# EAGLE design main (EAGLE 9.6.2)
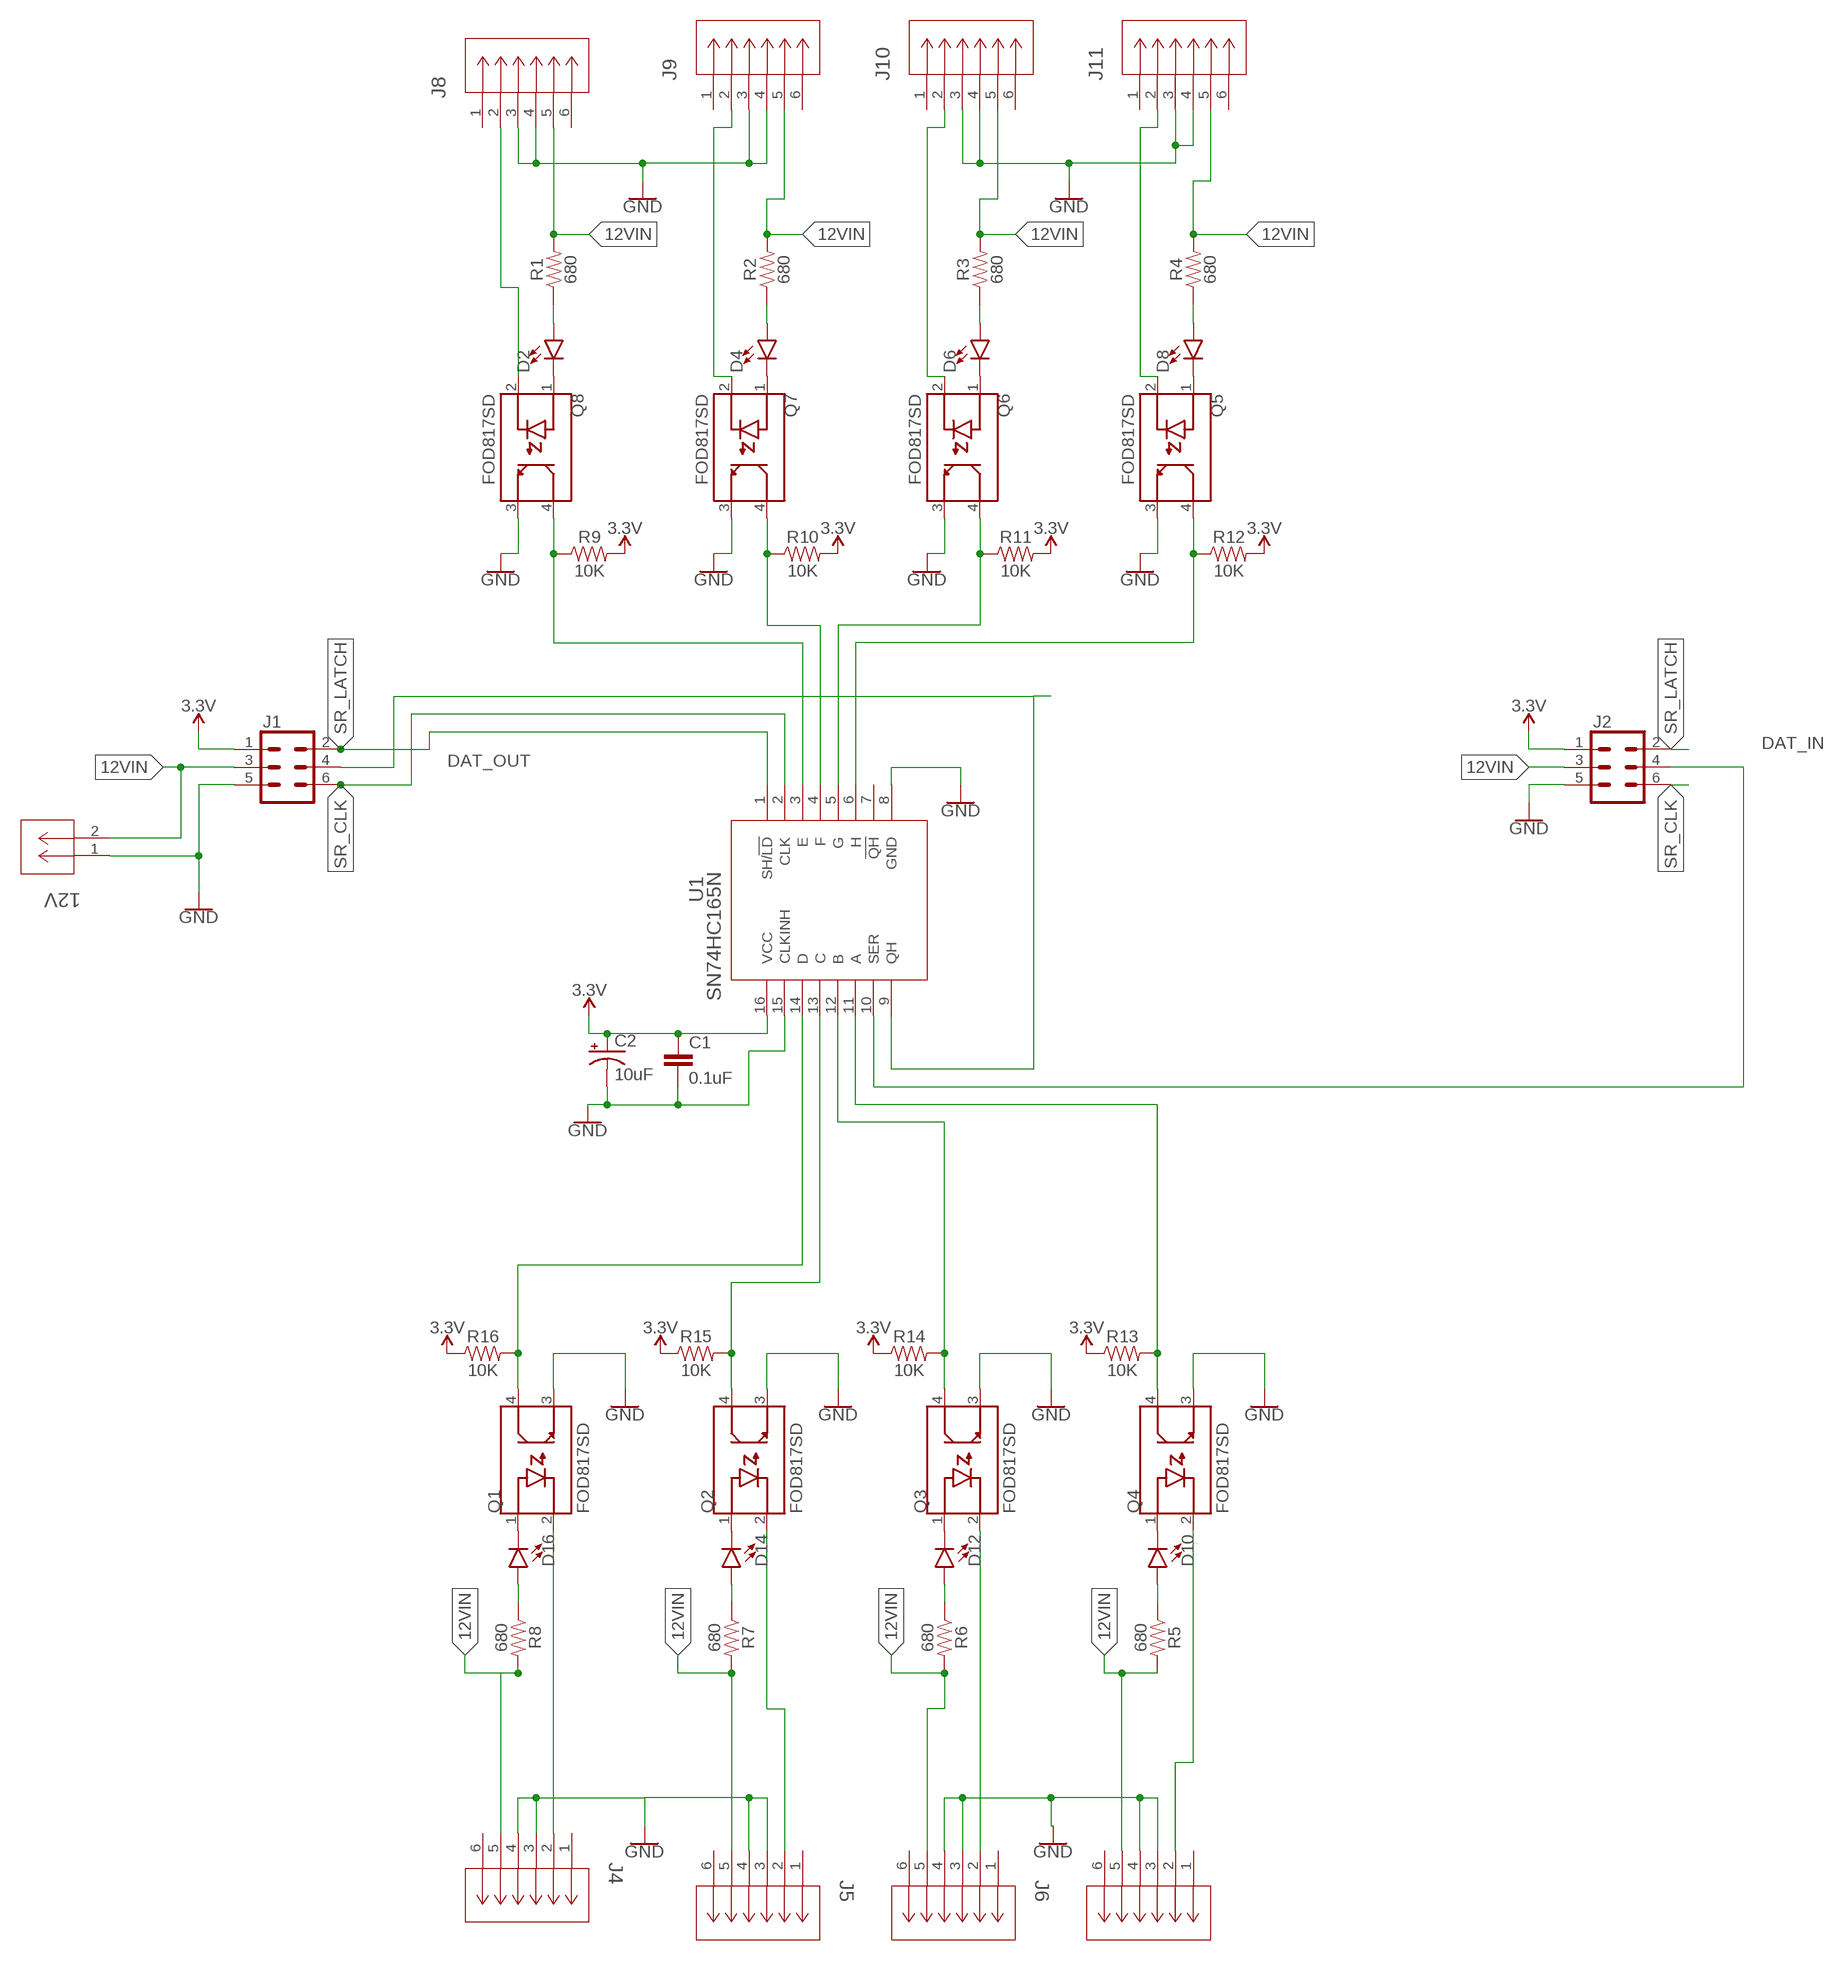
[diagram p0: schematic, sheet 1]

## Parts
12V  1725656  [CONN_1725656_PXC]
C1  0.1uF  0.1UF-0603-25V-5%  [0603]
C2  10uF  10UF-POLAR-RADIAL-2.5MM-25V-20%  [CPOL-RADIAL-2.5MM-5MM]
D2  LED0603  [LED-0603]
D4  LED0603  [LED-0603]
D6  LED0603  [LED-0603]
D8  LED0603  [LED-0603]
D10  LED0603  [LED-0603]
D12  LED0603  [LED-0603]
D14  LED0603  [LED-0603]
D16  LED0603  [LED-0603]
J1  CONN_03X2SHROUD  [2X3-SHROUDED]
J2  CONN_03X2SHROUD  [2X3-SHROUDED]
J4  E5566-Q0LK22-L  [CONN6_E5566_PUL]
J5  E5566-Q0LK22-L  [CONN6_E5566_PUL]
J6  E5566-Q0LK22-L  [CONN6_E5566_PUL]
J7  E5566-Q0LK22-L  [CONN6_E5566_PUL]
J8  E5566-Q0LK22-L  [CONN6_E5566_PUL]
J9  E5566-Q0LK22-L  [CONN6_E5566_PUL]
J10  E5566-Q0LK22-L  [CONN6_E5566_PUL]
J11  E5566-Q0LK22-L  [CONN6_E5566_PUL]
Q1  FOD817SD  [SOIC254P1016X385-4N]
Q2  FOD817SD  [SOIC254P1016X385-4N]
Q3  FOD817SD  [SOIC254P1016X385-4N]
Q4  FOD817SD  [SOIC254P1016X385-4N]
Q5  FOD817SD  [SOIC254P1016X385-4N]
Q6  FOD817SD  [SOIC254P1016X385-4N]
Q7  FOD817SD  [SOIC254P1016X385-4N]
Q8  FOD817SD  [SOIC254P1016X385-4N]
R1  680  RESISTOR1206  [1206]
R2  680  RESISTOR1206  [1206]
R3  680  RESISTOR1206  [1206]
R4  680  RESISTOR1206  [1206]
R5  680  RESISTOR1206  [1206]
R6  680  RESISTOR1206  [1206]
R7  680  RESISTOR1206  [1206]
R8  680  RESISTOR1206  [1206]
R9  10K  RESISTOR0603  [0603]
R10  10K  RESISTOR0603  [0603]
R11  10K  RESISTOR0603  [0603]
R12  10K  RESISTOR0603  [0603]
R13  10K  RESISTOR0603  [0603]
R14  10K  RESISTOR0603  [0603]
R15  10K  RESISTOR0603  [0603]
R16  10K  RESISTOR0603  [0603]
U1  SN74HC165N  [N16]

## Nets
3.3V: C1.1 C2.1(+) J1.1 J2.1 R9.2 R10.2 R11.2 R12.2 R13.1 R14.1 R15.1 R16.1 U1.16(VCC)
12VIN: 12V.2 J1.3 J2.3 J4.5 J5.5 J6.5 J7.5 J8.5 J9.5 J10.5 J11.5 R1.2 R2.2 R3.2 R4.2 R5.2 R6.2 R7.2 R8.2
DAT_IN: J2.4 U1.10(SER)
DAT_OUT: J1.4 U1.9(QH)
GND: 12V.1 C1.2 C2.2(-) J1.5 J2.5 J4.3 J4.4 J5.3 J5.4 J6.3 J6.4 J7.3 J7.4 J8.3 J8.4 J9.3 J9.4 J10.3 J10.4 J11.3 J11.4 Q1.3(EMITTER) Q2.3(EMITTER) Q3.3(EMITTER) Q4.3(EMITTER) Q5.3(EMITTER) Q6.3(EMITTER) Q7.3(EMITTER) Q8.3(EMITTER) U1.8(GND) U1.15(CLKINH)
N$1: J7.2 Q4.2(CATHODE)
N$2: D16.C Q1.1(ANODE)
N$3: D2.A R1.1
N$4: J6.2 Q3.2(CATHODE)
N$5: D14.C Q2.1(ANODE)
N$6: D4.A R2.1
N$7: J5.2 Q2.2(CATHODE)
N$8: D12.C Q3.1(ANODE)
N$9: D6.A R3.1
N$10: J4.2 Q1.2(CATHODE)
N$11: D10.C Q4.1(ANODE)
N$12: D8.A R4.1
N$13: J8.2 Q8.2(CATHODE)
N$14: D8.C Q5.1(ANODE)
N$15: D10.A R5.1
N$16: J9.2 Q7.2(CATHODE)
N$17: D6.C Q6.1(ANODE)
N$18: D12.A R6.1
N$19: J10.2 Q6.2(CATHODE)
N$20: D4.C Q7.1(ANODE)
N$21: D14.A R7.1
N$22: J11.2 Q5.2(CATHODE)
N$23: D2.C Q8.1(ANODE)
N$24: D16.A R8.1
N$25: Q8.4(COLLECTOR) R9.1 U1.3(E)
N$26: Q7.4(COLLECTOR) R10.1 U1.4(F)
N$27: Q6.4(COLLECTOR) R11.1 U1.5(G)
N$28: Q5.4(COLLECTOR) R12.1 U1.6(H)
N$29: Q4.4(COLLECTOR) R13.2 U1.11(A)
N$30: Q3.4(COLLECTOR) R14.2 U1.12(B)
N$31: Q2.4(COLLECTOR) R15.2 U1.13(C)
N$32: Q1.4(COLLECTOR) R16.2 U1.14(D)
SR_CLK: J1.6 J2.6 U1.2(CLK)
SR_LATCH: J1.2 J2.2 U1.1(SH/!LD)
Unconnected: J4.1 J4.6 J5.1 J5.6 J6.1 J6.6 J7.1 J7.6 J8.1 J8.6 J9.1 J9.6 J10.1 J10.6 J11.1 J11.6 U1.7(!QH)

## Library data of the parts
12V = 1725656:1725656; BUILT_BY: EMA_Cory; COPYRIGHT: Copyright (C) 2018 Accelerated Designs. All rights reserved; MANUFACTURER_PART_NUMBER: 1725656; SOURCELIBRARY: Phoenix_Contact_2020-01-22; VENDOR: Phoenix Contact
C1 = SparkFun-Capacitors:0.1UF: 0.1µF ceramic capacitors A capacitor is a passive two-terminal electrical component used to store electrical energy temporarily in an electric field.; PROD_ID: CAP-08604
C2 = SparkFun-Capacitors:10UF-POLAR: 10.0µF polarized capacitors A capacitor is a passive two-terminal electrical component used to store electrical energy temporarily in an electric field.; PROD_ID: CAP-08440
D2 D4 D6 D8 D10 D12 D14 D16 = SparkFun-LED:LED: LED (Generic) Standard schematic elements and footprints for 5mm, 3mm, 1206, and 0603 sized LEDs. Generic LEDs with no color specified.
J1 J2 = SparkFun-Connectors:CONN_03X2: Multi connection point. Often used as Generic Header-pin footprint for 0.1 inch spaced/style header connections You can populate with any combo of single row headers, but if you'd like an exact match, check these: Header - 2x3 (Male, 0.1") <https://www.sparkfun.com/products/12807> (PRT-12807) Header - 2x3 (Female, 0.1") <https://www.sparkfun.com/products/13010> (PRT-13010) 2x3 Pin Shrouded Header <https://www.sparkfun.com/products/10877> (PRT-10877) On any of the 0.1 inch spaced packages, you can populate with these: Break Away Headers - Straight <https://www.sparkfun.com/products/116> (PRT-00116) Break Away Male Headers - Right Angle <https://www.sparkfun.com/products/553> (PRT-00553) Female Headers <https://www.sparkfun.com/products/115> (PRT-00115) Break Away Headers - Machine Pin <https://www.sparkfun.com/products/117> (PRT-00117) Break Away Female Headers - Swiss Machine Pin <https://www.sparkfun.com/products/743> (PRT-00743) Special note: the shrouded connector mates well with our 3x2 ribbon cables: Ribbon Crimp Connector - 6-pin (2x3, Female) <https://www.sparkfun.com/products/10651> (PRT-10651) Ribbon Cable - 6 wire (15ft) <https://www.sparkfun.com/products/10646> (PRT-10646); PROD_ID: CONN-10681; SF_ID: PRT_10877
J4-J11 = E5566:E5566-Q0LK22-L; BUILT_BY: EMA_Don; COPYRIGHT: Copyright (C) 2016 Accelerated Designs. All rights reserved; MANUFACTURER_PART_NUMBER: E5566-Q0LK22-L; SOURCELIBRARY: Pulse_Electronics_2018-08-17; VENDOR: Pulse Electronics Corporation
Q1-Q8 = FOD817SD:FOD817SD: DIP4 Surface Mount Single Channel 70 V 5000 Vrms Phototransistor Optocoupler; DESCRIPTION: Optoisolator Transistor Output 5000Vrms 1 Channel 4-SMD; DIGI-KEY_PART_NUMBER: FOD817SDCT-ND; MF: ON Semiconductor; MP: FOD817SD; PACKAGE: PDIP GW-4 ON Semiconductor; PURCHASE-URL: https://pricing.snapeda.com/search/part/FOD817SD/?ref=eda
R1-R16 = SparkFun-Resistors:RESISTOR: Generic Resistor Package
U1 = SN74HC165N:SN74HC165N; DATASHEET_URL: http://www.ti.com/lit/gpn/SN74HC165; DESCRIPTION: 8-Bit Parallel-Load Shift Registers; FAMILY_NAME: SHIFT REGISTER; GENERIC_PART_NUMBER: SN74HC165; INDUSTRY_STD_PKG_TYPE: PDIP; MANUFACTURER: Texas Instruments; PACKAGE_DESIGNATOR: N; PIN_COUNT: 16

## Board
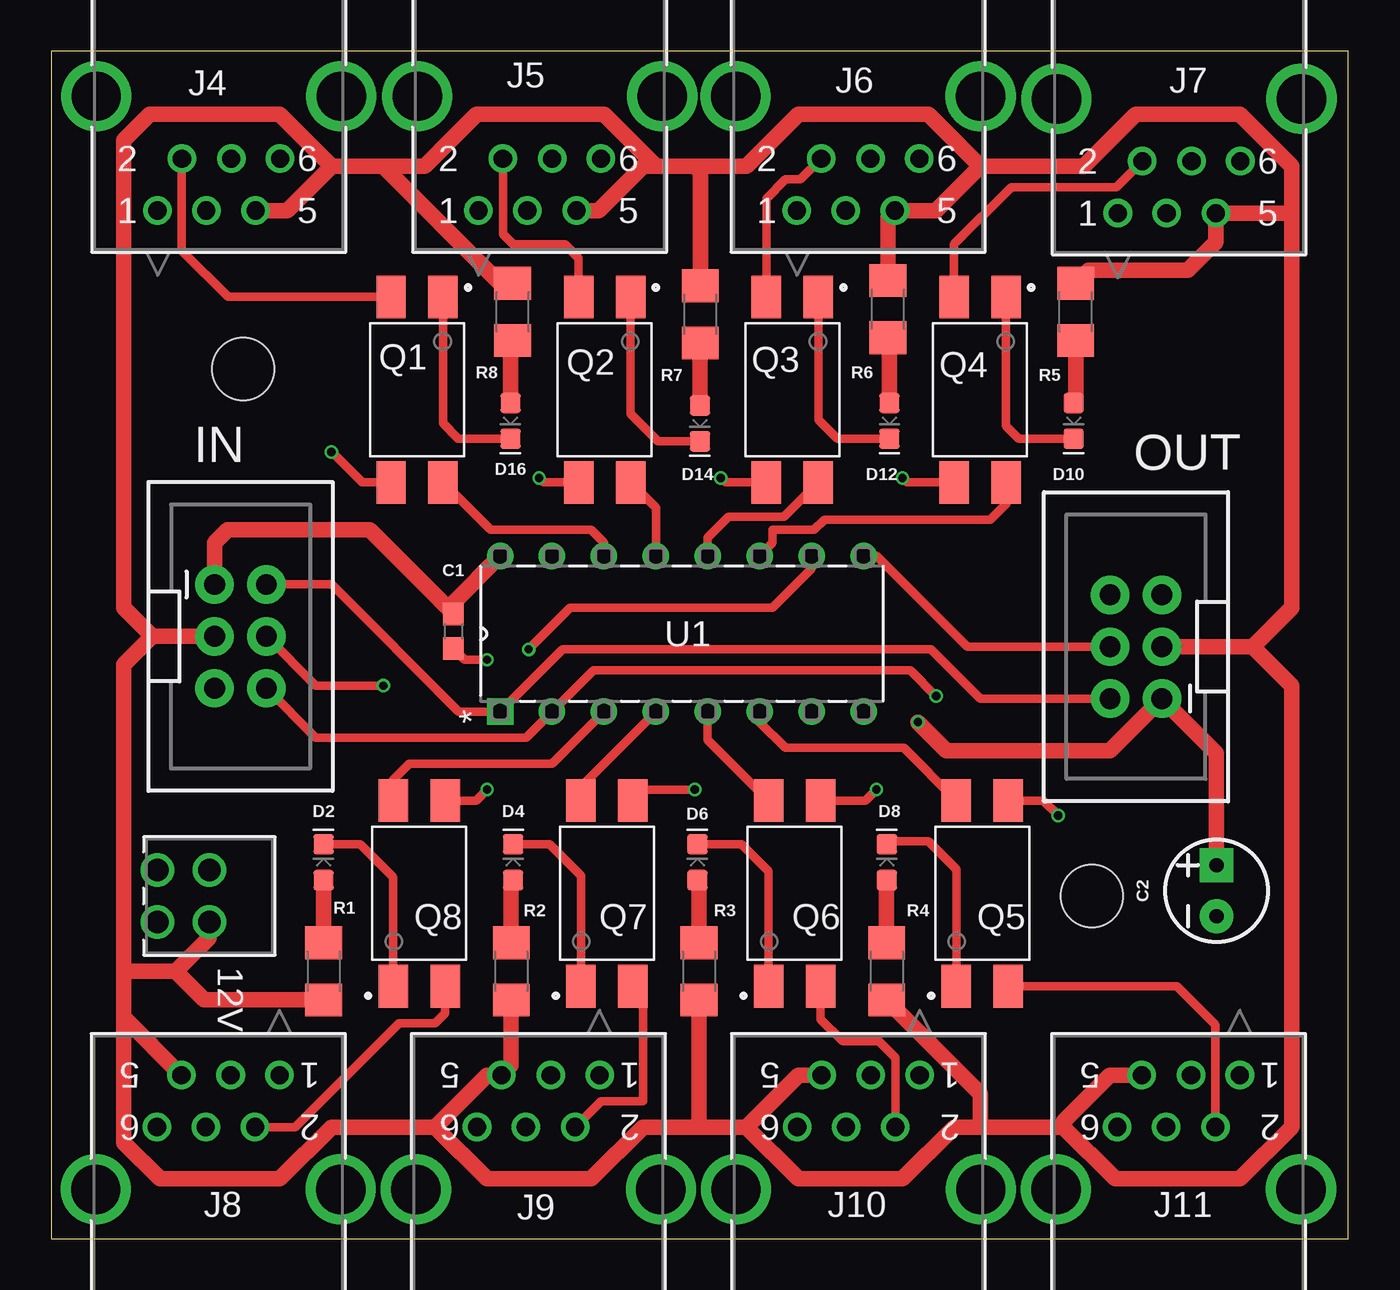
[diagram p1: board, top side]
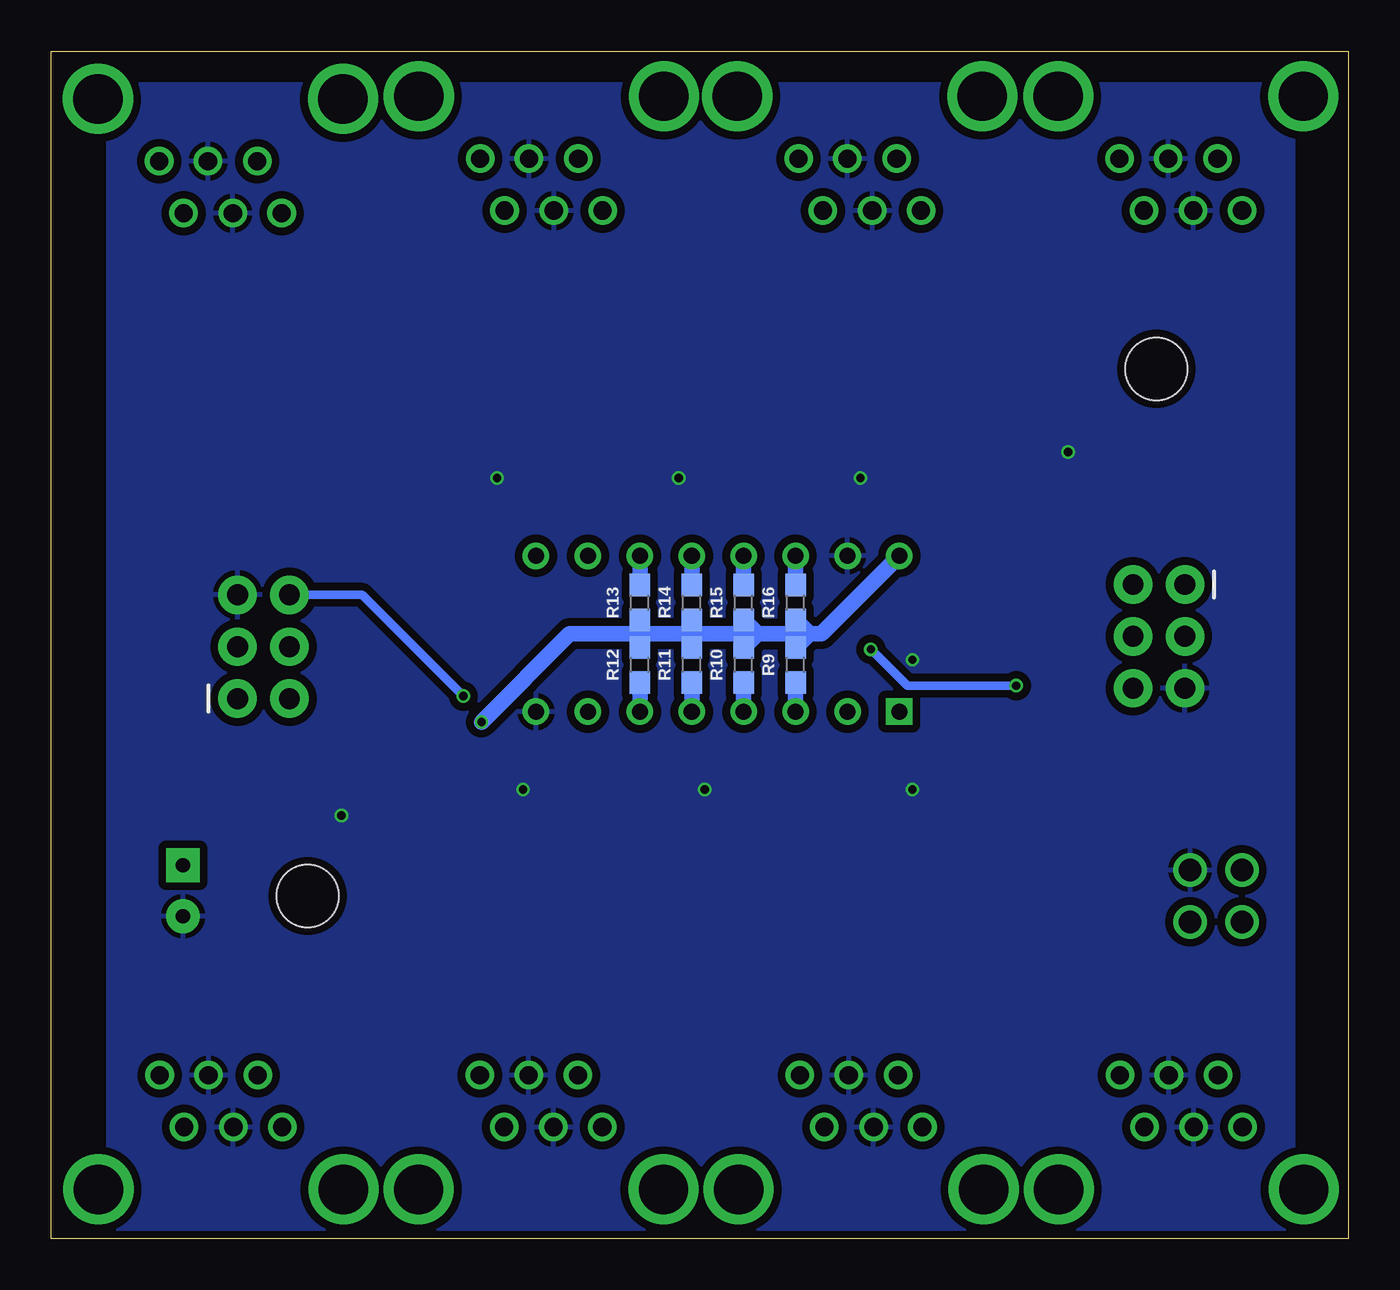
[diagram p2: board, bottom side, seen from below]

Size 63.48 x 58.09 mm. Coordinates in mm from the lower left corner, seen from the top.
Outline: 0,0 63.48,0 63.48,58.09 0,58.09 0,0
Copper layers (1*16): Top 0.035559375mm / dielectric 1.6mm / Bottom 0.035559375mm
Design rules "oshpark-2layer": minimum track width 6mil, minimum drill 10mil, track to track 6mil, track to pad 6mil, pad to pad 6mil, via to via 6mil, smd to smd 6mil, copper to edge 15mil, drill to drill 6mil, minimum pad ring 5mil, minimum via ring 5mil, stop-mask expansion 2.5mil, vias tented up to drill 0mil, thermal gap 10mil
Holes 3.05 mm at 50.93,16.76 9.4,42.54

### Footprints (pad centres in the part's own frame; a part is rotated, then mirrored left to right if it is on the bottom)
CONN_1725656_PXC = drill 1.092 pad 1.6: 1 0,0; 2 2.54,0; 3 0,-2.54; 4 2.54,-2.54
0603 = smd 1.1 x 1: 1 -0.85,0; 2 0.85,0
CPOL-RADIAL-2.5MM-5MM = drill 0.7 pad 1.651 square: 1 1.25,0 | drill 0.7 pad 1.651: 2 -1.25,0
LED-0603 = smd 1 x 1: A -0.877,0; C 0.877,0
2X3-SHROUDED = drill 1.016 pad 1.88: 1 -1.27,2.54; 2 1.27,2.54; 3 -1.27,0; 4 1.27,0; 5 -1.27,-2.54; 6 1.27,-2.54
CONN6_E5566_PUL = drill 0.889 pad 1.397: 1 0,0; 2 1.194,2.54; 3 2.388,0; 4 3.607,2.54; 5 4.801,0; 6 5.994,2.54 | drill 2.413 pad 2.413: 7 -2.997,5.588; 8 8.992,5.588
SOIC254P1016X385-4N = smd 2.09 x 1.44: 1 -4.54,1.27; 2 -4.54,-1.27; 3 4.54,-1.27; 4 4.54,1.27
1206 = smd 1.6 x 1.8: 1 -1.4,0; 2 1.4,0
N16 = drill 0.787 pad 1.295 square: 1 -7.62,17.78 | drill 0.787 pad 1.295: 2 -7.62,15.24; 3 -7.62,12.7; 4 -7.62,10.16; 5 -7.62,7.62; 6 -7.62,5.08; 7 -7.62,2.54; 8 -7.62,0; 9 0,0; 10 0,2.54; 11 0,5.08; 12 0,7.62; 13 0,10.16; 14 0,12.7; 15 0,15.24; 16 0,17.78

### Placement (x,y rotation side)
12V  7.75,18.03 270 top
C1  19.69,29.72 270 top
C2  57.02,17.02 90 top
D2  13.34,18.41 90 top
D4  22.61,18.41 90 top
D6  31.62,18.41 90 top
D8  40.89,18.41 90 top
D10  50.04,40.01 270 top
D12  41.02,40.01 270 top
D14  31.75,39.88 270 top
D16  22.48,40.01 270 top
J1  53.09,28.96 180 top
J2  9.27,29.46 0 top
J4  5.21,50.29 0 top
J5  20.91,50.29 0 top
J6  36.49,50.29 0 top
J7  52.2,50.16 0 top
J8  11.18,8 180 top
J9  26.84,8 180 top
J10  42.5,8 180 top
J11  58.17,8 180 top
Q1  17.91,41.53 270 top
Q2  27.09,41.53 270 top
Q3  36.27,41.53 270 top
Q4  45.46,41.53 270 top
Q5  45.56,16.89 90 top
Q6  36.38,16.89 90 top
Q7  27.2,16.89 90 top
Q8  18.01,16.89 90 top
R1  13.34,13.08 270 top
R2  22.52,13.08 270 top
R3  31.7,13.08 270 top
R4  40.88,13.08 270 top
R5  50.14,45.34 90 top
R6  40.95,45.47 90 top
R7  31.77,45.21 90 top
R8  22.59,45.34 90 top
R9  27.05,28.07 90 bottom
R10  29.59,28.07 90 bottom
R11  32.13,28.07 90 bottom
R12  34.67,28.07 90 bottom
R13  34.67,31.12 90 bottom
R14  32.13,31.12 90 bottom
R15  29.59,31.12 90 bottom
R16  27.05,31.12 90 bottom
U1  39.75,33.4 90 top

### Tracks (layer width: path | path; a pad name or v marks a point on that pad's centre or on a via)
3.3V  (via drill 0.4)
  Top 0.762: J2.1 8,34.04 8.64,34.67 15.58,34.67 C1.1 19.69,31.12 U1.16 | v42.42,25.27 43.81,23.88 51.82,23.88 J1.1 57.02,23.75 C2.1
  Bottom 0.762: U1.16 25.78,29.59 26.42,29.59 | 28.96,29.59 26.42,29.59 | R11.2 32.13,29.59 | R12.2 34.67,29.59 | 26.42,29.59 26.42,29.63 R16.1 | 26.42,29.59 26.42,29.55 R9.2 | 28.96,29.59 28.96,29.63 R15.1 | 28.96,29.59 28.96,29.55 R10.2 | v42.42,25.27 38.1,29.59 34.67,29.59 | 28.96,29.59 32.13,29.59 | 32.13,29.59 34.67,29.59 | 32.13,29.59 R14.1 | 34.67,29.59 R13.1
12VIN
  Top 0.762: J2.3 4.95,29.46 | 4.95,29.46 3.56,30.86 3.56,53.72 4.83,54.99 11.18,54.99 13.72,52.45 | 4.95,29.46 3.56,28.07 3.56,13.08 | 6.1,13.08 3.56,13.08 | 6.1,13.08 7.75,14.73 12V.2 | 3.56,13.08 3.56,10.82 | 3.56,10.82 J8.5 | 3.56,10.82 3.56,4.7 5.33,2.92 11.18,2.92 13.72,5.46 18.8,5.46 | 18.8,5.46 21.34,2.92 26.42,2.92 28.96,5.46 31.5,5.46 | 31.5,5.46 34.04,5.46 | 34.04,5.46 36.58,2.92 41.66,2.92 44.2,5.46 45.47,5.46 | 49.53,5.46 52.07,2.92 58.17,2.92 60.71,5.46 60.71,27.05 58.8,28.96 | 58.8,28.96 J1.3 | 45.47,5.46 49.53,5.46 | 13.72,52.45 16.26,52.45 | 16.26,52.45 18.29,52.45 20.83,54.99 27.05,54.99 29.59,52.45 | 29.59,52.45 28.96,52.45 26.8,50.29 J5.5 | 29.59,52.45 31.5,52.45 | 31.5,52.45 34.04,52.45 36.58,54.99 42.93,54.99 45.47,52.45 | 45.47,52.45 50.55,52.45 53.09,54.99 58.17,54.99 60.71,52.45 60.71,49.91 | 60.71,49.91 60.71,30.86 58.8,28.96 | J4.5 11.56,50.29 13.72,52.45 | 45.47,52.45 43.31,50.29 J6.5 40.95,49.95 R6.2 | 60.71,49.91 60.45,50.16 J7.5 57,48.74 55.63,47.37 50.77,47.37 R5.2 | J11.5 51.82,8 49.53,5.72 49.53,5.46 | J10.5 36.58,8 34.04,5.46 | 18.8,5.46 21.34,8 J9.5 22.52,8.48 R2.2 | R4.2 45.47,7.1 45.47,5.46 | R3.2 31.7,5.67 31.5,5.46 | R1.2 7.5,11.68 6.1,13.08 | R8.2 21.97,46.74 16.26,52.45 | R7.2 31.77,52.18 31.5,52.45
DAT_IN  (via drill 0.4)
  Top 0.406: J2.4 12.95,27.05 v16.26,27.05 | v23.37,28.83 25.4,30.86 35.31,30.86 37.21,32.77 U1.10
  Bottom 0.406: v16.26,27.05 21.59,27.05 v23.37,28.83
DAT_OUT
  Top 0.406: U1.9 40.39,33.4 44.83,28.96 J1.4
GND  (via drill 0.4)
  Top 0.406: Q1.3 15.21,36.99 v13.72,38.48 | Q2.3 24.1,36.99 v23.88,37.21 | Q3.3 32.99,36.99 v32.77,37.21 | Q4.3 41.88,36.99 v41.66,37.21 | Q5.3 48.55,21.43 v49.28,20.7 | Q6.3 39.85,21.43 v40.39,21.97 | Q7.3 29.01,21.97 v31.5,21.97 | Q8.3 20.8,21.43 v21.34,21.97 | C1.2 20.23,28.32 v21.34,28.32
  pour Bottom (isolate 0.381): 2.67,56.52 2.67,0.38 60.71,0.38 60.71,56.52
N$1
  Top 0.406: J7.2 52.12,51.43 46.99,51.43 44.19,48.63 Q4.2
N$2
  Top 0.406: Q1.1 19.18,39.88 19.93,39.13 D16.C
N$3
  Top 0.762: R1.1 D2.A
N$4
  Top 0.406: J6.2 36.67,51.82 35.94,51.82 35,50.88 Q3.2
N$5
  Top 0.406: D14.C 29.71,39 28.36,40.35 Q2.1
N$6
  Top 0.762: R2.1 22.52,17.45 D4.A
N$7
  Top 0.406: J5.2 22.11,49.14 22.61,48.64 25.15,48.64 25.82,47.97 Q2.2
N$8
  Top 0.406: D12.C 38.47,39.13 37.54,40.05 Q3.1
N$9
  Top 0.762: R3.1 31.7,17.46 D6.A
N$10
  Top 0.406: J4.2 6.4,48.34 8.67,46.07 Q1.2
N$11
  Top 0.406: D10.C 47.36,39.13 46.73,39.76 Q4.1
N$12
  Top 0.762: R4.1 40.88,17.53 D8.A
N$13
  Top 0.406: Q8.2 19.28,11.03 18.8,10.54 17.02,10.54 11.94,5.46 J8.2
N$14
  Top 0.406: D8.C 41.03,19.43 42.93,19.43 44.29,18.06 Q5.1
N$15
  Top 0.762: D10.A 50.13,40.98 R5.1
N$16
  Top 0.406: J9.2 26.92,6.73 28.96,6.73 28.96,11.86 Q7.2
N$17
  Top 0.406: D6.C 33.79,19.29 35.11,17.98 Q6.1
N$18
  Top 0.762: D12.A 41.02,44 R6.1
N$19
  Top 0.406: J10.2 41.31,8.86 40.51,9.65 38.73,9.65 37.65,10.74 Q6.2
N$20
  Top 0.406: D4.C 24.4,19.29 25.93,17.76 Q7.1
N$21
  Top 0.762: D14.A 31.75,43.79 R7.1
N$22
  Top 0.406: J11.2 56.97,10.47 55.09,12.35 Q5.2
N$23
  Top 0.406: D2.C 15.12,19.29 16.74,17.67 Q8.1
N$24
  Top 0.762: D16.A 22.48,43.83 R8.1
N$25
  Top 0.406: U1.3 24.51,23.24 17.53,23.24 16.74,22.46 Q8.4
  Bottom 0.762: R9.1 U1.3
N$26
  Top 0.406: Q7.4 25.93,22.12 U1.4
  Bottom 0.762: R10.1 U1.4
N$27
  Top 0.406: Q6.4 32.13,24.41 U1.5
  Bottom 0.762: R11.1 U1.5
N$28
  Top 0.406: Q5.4 41.72,24 35.94,24 34.67,25.27 U1.6
  Bottom 0.762: R12.1 U1.6
N$29
  Top 0.406: Q4.4 46.74,36.98 46.74,35.94 45.97,35.18 37.85,35.18 37.34,34.67 35.31,34.67 35.31,34.04 U1.11
  Bottom 0.762: R13.2 U1.11
N$30
  Top 0.406: Q3.4 35.86,35.31 33.15,35.31 32.13,34.29 U1.12
  Bottom 0.762: R14.2 U1.12
N$31
  Top 0.406: Q2.4 29.59,35.76 U1.13
  Bottom 0.762: R15.2 U1.13
N$32
  Top 0.406: Q1.4 21.5,34.67 26.42,34.67 27.05,34.04 U1.14
  Bottom 0.762: R16.2 U1.14
SR_CLK  (via drill 0.4)
  Top 0.406: J2.6 12.95,24.51 23.24,24.51 U1.2 26.54,27.81 42.04,27.81 v43.31,26.54
  Bottom 0.406: J1.6 48.26,31.5 v43.31,26.54
SR_LATCH
  Top 0.406: J2.2 13.72,32 19.94,25.78 U1.1 25.02,28.83 43.05,28.83 45.47,26.42 J1.2

### Text on the board
tNames: IN | OUT